# EAGLE design LilyPad_Rainbow_LED_v02 (EAGLE 7.7.0)
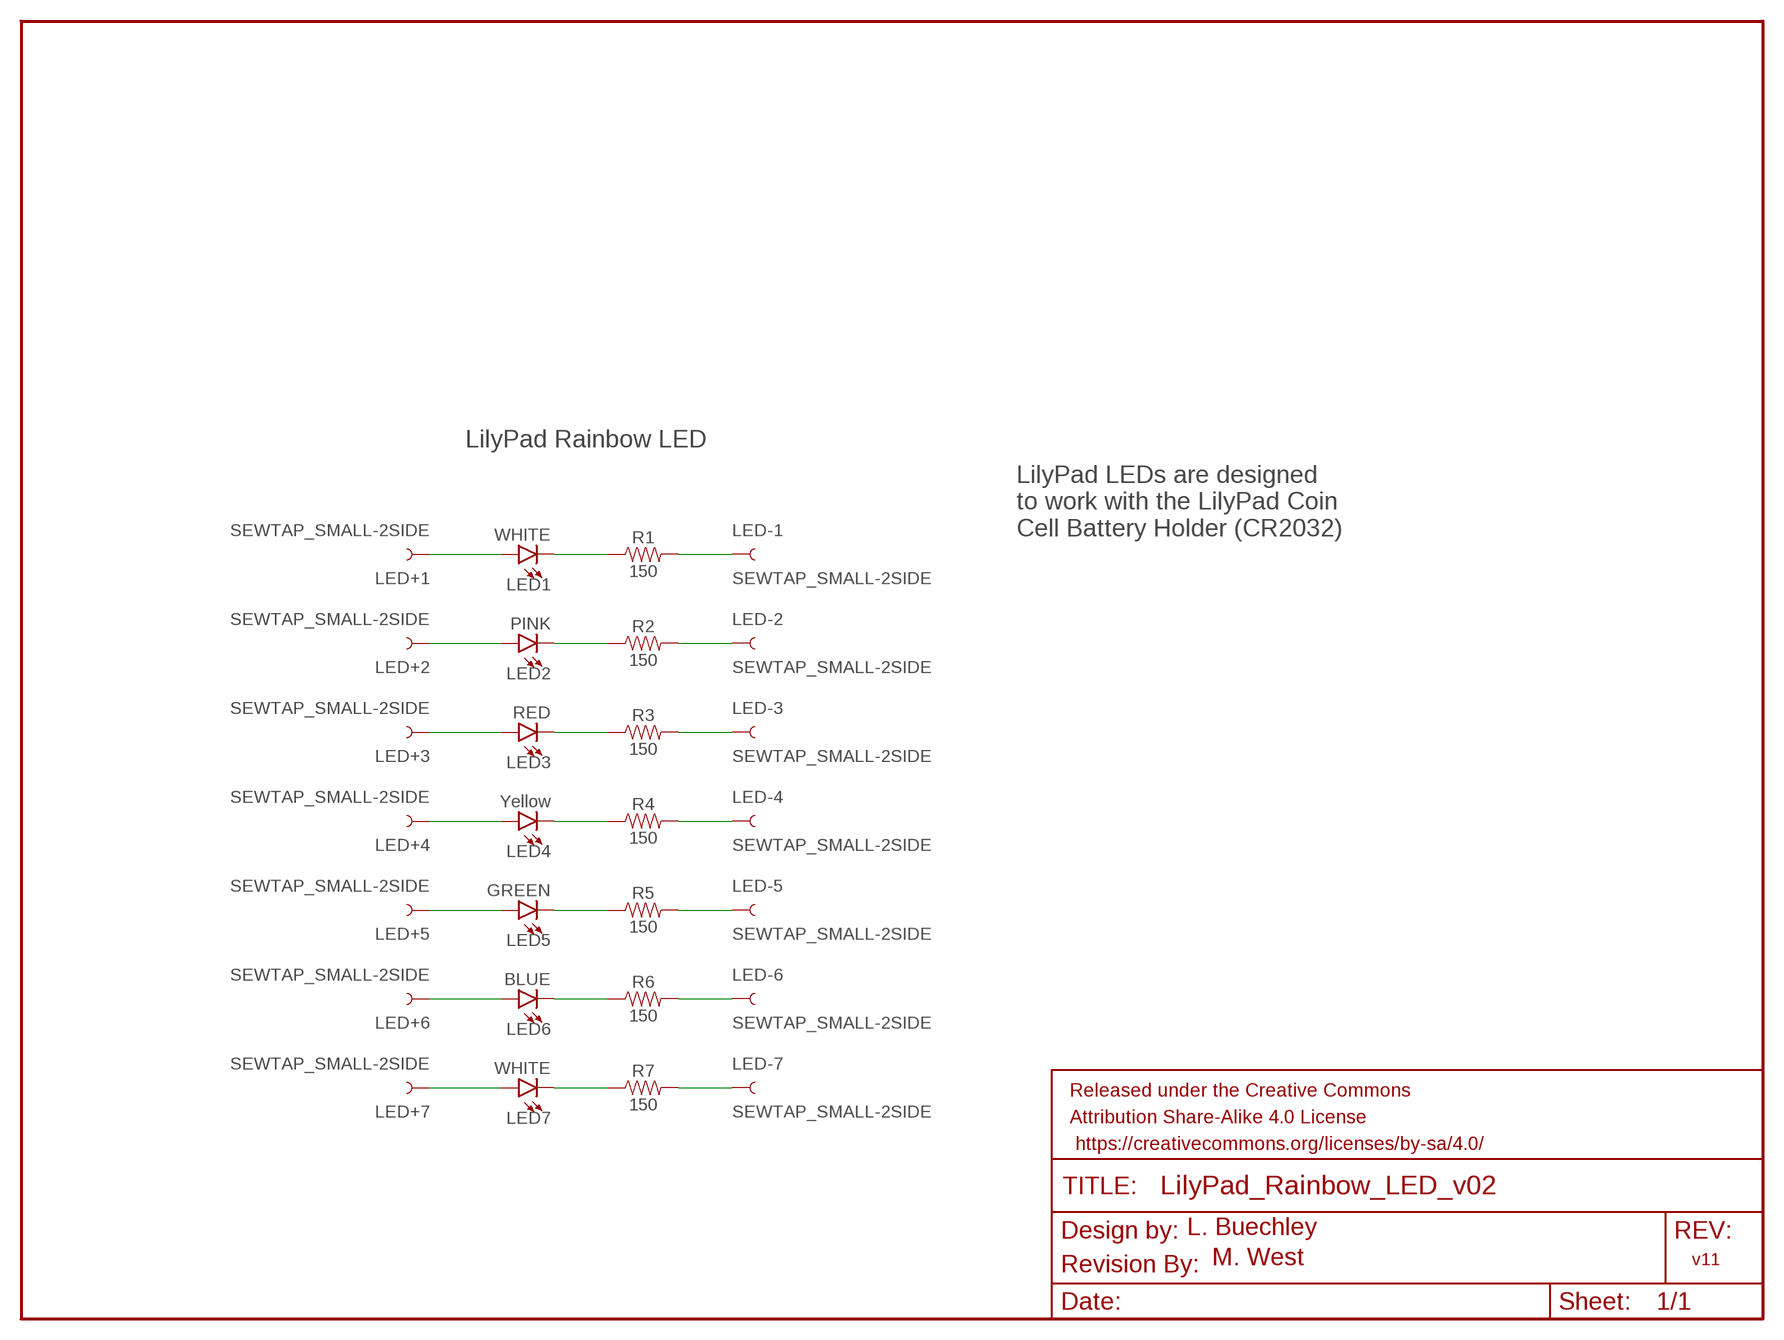
[diagram p0: schematic, sheet 1]

## Parts
FRAME1  FRAME-LETTER  [CREATIVE_COMMONS]
LED1  WHITE  LED-WHITE1206  [LED-1206]
LED2  PINK  LED-PINK1206  [LED-1206]
LED3  RED  LED-RED1206  [LED-1206]
LED4  Yellow  LED-YELLOWLILYPAD  [LED-1206]
LED5  GREEN  LED-GREENLILYPAD  [LED-1206]
LED6  BLUE  LED-BLUE1206  [LED-1206]
LED7  WHITE  LED-WHITE1206  [LED-1206]
LED+1  SEWTAP_SMALL-2SIDE  [PETAL-SMALL-2SIDE]
LED+2  SEWTAP_SMALL-2SIDE  [PETAL-SMALL-2SIDE]
LED+3  SEWTAP_SMALL-2SIDE  [PETAL-SMALL-2SIDE]
LED+4  SEWTAP_SMALL-2SIDE  [PETAL-SMALL-2SIDE]
LED+5  SEWTAP_SMALL-2SIDE  [PETAL-SMALL-2SIDE]
LED+6  SEWTAP_SMALL-2SIDE  [PETAL-SMALL-2SIDE]
LED+7  SEWTAP_SMALL-2SIDE  [PETAL-SMALL-2SIDE]
LED-1  SEWTAP_SMALL-2SIDE  [PETAL-SMALL-2SIDE]
LED-2  SEWTAP_SMALL-2SIDE  [PETAL-SMALL-2SIDE]
LED-3  SEWTAP_SMALL-2SIDE  [PETAL-SMALL-2SIDE]
LED-4  SEWTAP_SMALL-2SIDE  [PETAL-SMALL-2SIDE]
LED-5  SEWTAP_SMALL-2SIDE  [PETAL-SMALL-2SIDE]
LED-6  SEWTAP_SMALL-2SIDE  [PETAL-SMALL-2SIDE]
LED-7  SEWTAP_SMALL-2SIDE  [PETAL-SMALL-2SIDE]
R1  150  150OHM-0603-1/10W-1%  [0603]
R2  150  150OHM-0603-1/10W-1%  [0603]
R3  150  150OHM-0603-1/10W-1%  [0603]
R4  150  150OHM-0603-1/10W-1%  [0603]
R5  150  150OHM-0603-1/10W-1%  [0603]
R6  150  150OHM-0603-1/10W-1%  [0603]
R7  150  150OHM-0603-1/10W-1%  [0603]
U$1  REVISION  [REVISION]

## Nets
N$1: LED1.A LED+1.1
N$2: LED1.C R1.1
N$3: LED-1.1 R1.2
N$4: LED2.A LED+2.1
N$5: LED2.C R2.1
N$6: LED-2.1 R2.2
N$7: LED3.A LED+3.1
N$8: LED3.C R3.1
N$9: LED-3.1 R3.2
N$10: LED4.A LED+4.1
N$11: LED4.C R4.1
N$12: LED-4.1 R4.2
N$13: LED5.A LED+5.1
N$14: LED5.C R5.1
N$15: LED-5.1 R5.2
N$16: LED6.A LED+6.1
N$17: LED6.C R6.1
N$18: LED-6.1 R6.2
N$19: LED7.A LED+7.1
N$20: LED7.C R7.1
N$21: LED-7.1 R7.2

## Notes on the sheet
- LilyPad Rainbow LED
- LilyPad LEDs are designed
  to work with the LilyPad Coin
  Cell Battery Holder (CR2032)
- L. Buechley
- M. West | v11

## Library data of the parts
FRAME1 = SparkFun-Aesthetics:FRAME-LETTER: Schematic Frame - Letter Standard 8.5x11 US Letter frame
LED1 LED7 = SparkFun-LED:LED-WHITE: White SMD LED Used in manufacturing several products at SparkFun. Packages: 0603 - Bright White SMD 0603 package[Product Link] <http://www.kingbrightusa.com/product.asp?catalog_name=LED&product_id=APT1608QWF/D> 1206 - Bright White SMD1206 package [Product Link] <http://www.kingbrightusa.com/product.asp?catalog_name=LED&product_id=APT3216QWF/D> SparkFun Products: Blackberry Trackballer Breakout <https://www.sparkfun.com/products/13169> Digital SandBox <https://www.sparkfun.com/products/12651>; PROD_ID: DIO-09955
LED2 = SparkFun-LED:LED-PINK: Pink SMD LED Used in manufacturing of various products at SparkFun Packages: 0603 - SMD 0603 package [Product Link] <http://cdn.sparkfun.com/datasheets/Components/General/S1206PKSBJC.pdf> SparkFun Products: LilyPad LED Pink <https://www.sparkfun.com/products/10962>; PROD_ID: DIO-10415
LED3 = SparkFun-LED:LED-RED: Red SMD LED Used in manufacturing of most products at SparkFun Packages: 0603 - SMD 0603 package [Product Link] <http://docs.avagotech.com/docs/AV02-0551EN> 0603 SMART - SMD 0603 SMART package ( more efficient and expensive)[Product Link] <http://www.osram-os.com/Graphics/XPic2/00077099_0.pdf> 1206 - SMD1206 package [Product Link] <https://www.sparkfun.com/datasheets/DevTools/LilyPad/Q150OVS4.pdff> SparkFun Products: Pro Mini 328 -5V <https://www.sparkfun.com/products/821> RedBoard <https://www.sparkfun.com/products/12757> IOIO-OTG <https://www.sparkfun.com/products/13613>; PROD_ID: DIO-09912
LED4 = SparkFun-LED:LED-YELLOW: Yellow SMD LED Used in manufacturing several products at SparkFun. Packages: 0603 - SMD 0603 package[Product Link] <http://www.kingbrightusa.com/product.asp?catalog_name=LED&product_id=APT1608SYCK> 0603 -SMART - SMART SMD 0603 package (more efficient/more expensive) [Product Link] <http://www.osram-os.com/osram_os/en/products/product-catalog/led-light-emitting-diodes/smartled-0603/ly-l29k/index.jsp> LilyPad - SMD1206 package[Product Datasheet] <https://www.sparkfun.com/datasheets/DevTools/LilyPad/Q150YUS4.pdf> SparkFun Products: Blynk Board <https://www.sparkfun.com/products/13794> IOIO-OTG <https://www.sparkfun.com/products/13613> XBee Explorer Serial <https://www.sparkfun.com/products/13225>; PROD_ID: DIO-09909
LED5 = SparkFun-LED:LED-GREEN: Green SMD LED Used in manufacturing of various products at SparkFun Packages: 0603 - SMD 0603 package [Product Link] <http://www.futureelectronics.com/en/technologies/semiconductors/optoelectronics/leds/Pages/9894312-LTST-C190GKT.aspx?CrossPart=HSMG-C190&IM=0> LilyPad 1206 - SMD1206 LilyPad package [Product Link] <http://www.futureelectronics.com/en/Technologies/Product.aspx?ProductID=IN150NGHARVATEKCORPORATION2049943&IM=0> 1206 - SMD1206 package [Product Link] <http://www.futureelectronics.com/en/technologies/semiconductors/optoelectronics/leds/Pages/8315665-LTST-C150KGKT.aspx?IM=0> 1206 Bottom Mount -SMD 1206 Bottom Mount [Product Link] <http://www.digikey.com/product-detail/en/lite-on-inc/LTST-C230KGKT/160-1456-1-ND/386854> SparkFun Products: Pro Mini 328 -5V <https://www.sparkfun.com/products/821> RedBoard <https://www.sparkfun.com/products/12757> MP3 Trigger <https://www.sparkfun.com/products/13720> Makey Makey <https://www.sparkfun.com/products/11076>; PROD_ID: DIO-09910
LED6 = SparkFun-LED:LED-BLUE: Blue SMD LED Used in manufacturing of various products at SparkFun Packages: 0603 - SMD 0603 package [Product Link] <http://www.digikey.com/product-detail/en/SMLE12BC7TT86/511-1589-2-ND/1641808> 1206 - SMD1206 package [Product Link] <http://www.digikey.com/product-detail/en/lite-on-inc/LTST-C150TBKT/160-1643-1-ND/573584> SparkFun Products: ESP8266 Thing-Dev Board <https://www.sparkfun.com/products/13711> RedBoard <https://www.sparkfun.com/products/12757>; PROD_ID: DIO-09911
LED+1-LED+7 LED-1-LED-7 = LilyPad-Wearables:SEWTAP: SparkFun LilyPad Sew Taps Sewable connection points for LilyPad Boards SparkFun Products: LilyPad Arduino 328 Main Board <https://www.sparkfun.com/products/13342> LilyTiny <https://www.sparkfun.com/products/10899> LilyPad Power Supply <https://www.sparkfun.com/products/11259>
R1-R7 = SparkFun-Resistors:150OHM: 150Ω resistor A resistor is a passive two-terminal electrical component that implements electrical resistance as a circuit element. Resistors act to reduce current flow, and, at the same time, act to lower voltage levels within circuits. - Wikipedia; PROD_ID: RES-11028
U$1 = SparkFun-Aesthetics:REVISION: "Revision By" Text Preceding text for revisor documentation. Includes schematic text on "symbols" layer, and board text on tDoc.

## Board
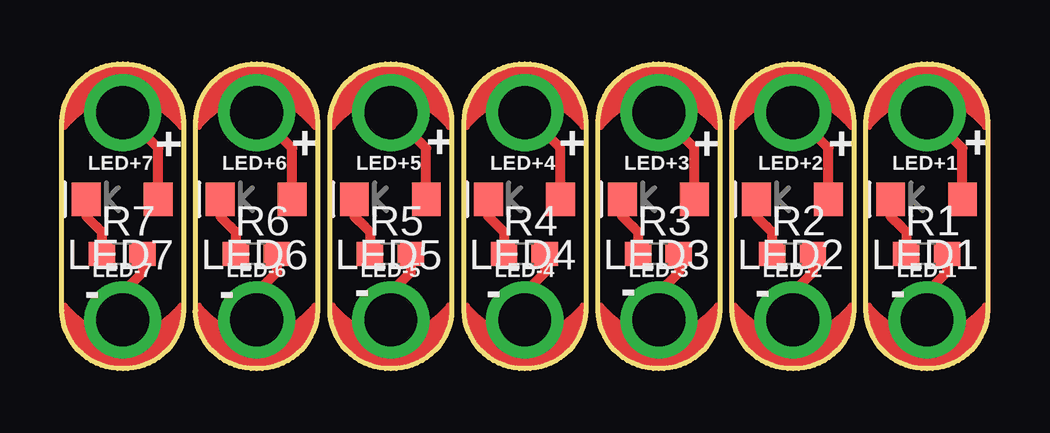
[diagram p1: board, top side]
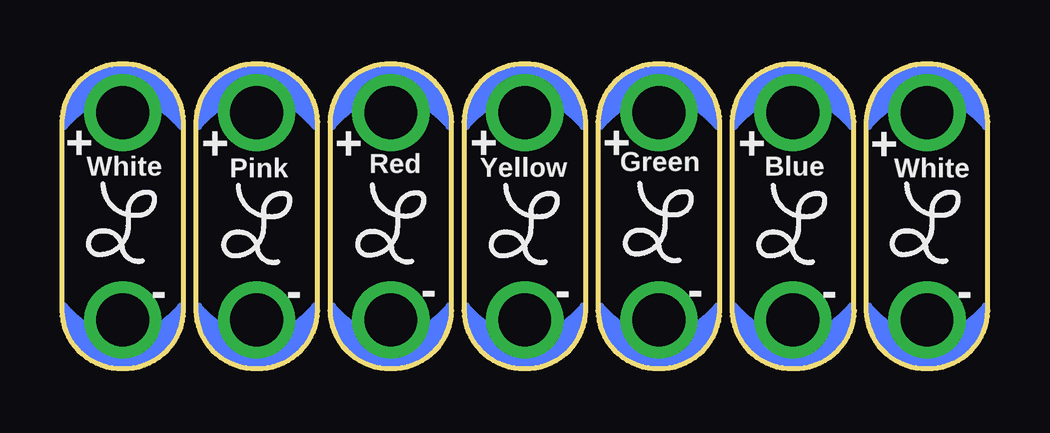
[diagram p2: board, bottom side, seen from below]

Size 38.61 x 12.7 mm. Coordinates in mm from the lower left corner, seen from the top.
Outline: 8.13,0 arc90 10.67,2.41 10.67,10.29 arc90 8.13,12.7 arc90 5.59,10.29 5.59,2.41
Outline: 8.1,0 arc-90 5.56,2.41
Outline: 27.43,10.29 27.43,2.41 arc-90 24.89,0 arc-90 22.35,2.41 22.35,10.29 arc-90 24.89,12.7 arc-90 27.43,10.29
Outline: 2.54,12.7 arc-90 5.08,10.29 5.08,2.41 arc-90 2.54,0 arc-90 0,2.41 0,10.29 arc-90 2.54,12.7
Outline: 13.72,12.7 arc-90 16.26,10.29 16.26,2.41 arc-90 13.72,0 arc-90 11.18,2.41 11.18,10.29 arc-90 13.72,12.7
Outline: 19.3,12.7 arc-90 21.84,10.29 21.84,2.41 arc-90 19.3,0 arc-90 16.76,2.41 16.76,10.29 arc-90 19.3,12.7
Outline: 30.48,12.7 arc-90 33.02,10.29 33.02,2.41 arc-90 30.48,0 arc-90 27.94,2.41 27.94,10.29 arc-90 30.48,12.7
Outline: 36.07,12.7 arc-90 38.61,10.29 38.61,2.41 arc-90 36.07,0 arc-90 33.53,2.41 33.53,10.29 arc-90 36.07,12.7
Copper layers (1*16): Top 0.035mm / dielectric 1.5mm / Bottom 0.035mm
Design rules "SparkFun-2-layer-STANDARD": minimum track width 10mil, minimum drill 20mil, track to track 10mil, track to pad 8mil, pad to pad 8mil, via to via 10mil, smd to smd 8mil, copper to edge 8mil, drill to drill 8mil, minimum pad ring 10mil, minimum via ring 10mil, stop-mask expansion 4mil, vias tented up to drill 25mil, thermal gap 10mil

### Footprints (pad centres in the part's own frame; a part is rotated, then mirrored left to right if it is on the bottom)
LED-1206 = smd 1.2 x 1.4: A -1.5,0; C 1.5,0
PETAL-SMALL-2SIDE = drill 2.2: 1 0,0
0603 = smd 1.1 x 1: 1 -0.85,0; 2 0.85,0

### Placement (x,y rotation side)
FRAME1  14.73,-8.26 0 top  (outside the outline)
LED1  36.05,7.06 180 top
LED2  30.46,7.06 180 top
LED3  24.87,7.06 180 top
LED4  19.28,7.06 180 top
LED5  13.7,7.06 180 top
LED6  8.11,7.06 180 top
LED7  2.52,7.06 180 top
LED+1  36.07,10.67 180 top
LED+2  30.48,10.67 180 top
LED+3  24.89,10.67 180 top
LED+4  19.3,10.67 180 top
LED+5  13.72,10.67 180 top
LED+6  8.13,10.67 180 top
LED+7  2.54,10.67 180 top
LED-1  36.07,2.03 0 top
LED-2  30.48,2.03 0 top
LED-3  24.89,2.03 0 top
LED-4  19.3,2.03 0 top
LED-5  13.72,2.03 0 top
LED-6  8.13,2.03 0 top
LED-7  2.54,2.03 0 top
LOGO29  LOGO-LPL  [LOGO-L]  24.89,6.05 0 bottom
LOGO30  LOGO-LPL  [LOGO-L]  2.62,6.07 0 bottom
LOGO31  LOGO-LPL  [LOGO-L]  8.18,6.02 0 bottom
LOGO32  LOGO-LPL  [LOGO-L]  13.74,6.1 0 bottom
LOGO33  LOGO-LPL  [LOGO-L]  19.33,6.02 0 bottom
LOGO34  LOGO-LPL  [LOGO-L]  30.48,6.02 0 bottom
LOGO35  LOGO-LPL  [LOGO-L]  36.12,6.07 0 bottom
R1  36.05,4.78 0 top
R2  30.46,4.78 0 top
R3  24.87,4.78 0 top
R4  19.28,4.78 0 top
R5  13.7,4.78 0 top
R6  8.11,4.78 0 top
R7  2.52,4.78 0 top
U$1  26.16,-10.79 0 top  (outside the outline)

### Tracks (layer width: path | path; a pad name or v marks a point on that pad's centre or on a via)
N$1
  Top 0.406: LED1.A 37.55,9.19 LED+1.1
N$2
  Top 0.254: 34.99,5.91 35.05,5.84
  Top 0.406: LED1.C 34.55,6.35 34.99,5.91 35.2,5.7 R1.1
N$3
  Top 0.406: LED-1.1 36.07,3.17 36.9,4 R1.2
N$4
  Top 0.406: LED2.A 31.96,9.19 LED+2.1
N$5
  Top 0.254: 29.4,5.91 29.46,5.84
  Top 0.406: LED2.C 28.96,6.35 29.4,5.91 29.61,5.7 R2.1
N$6
  Top 0.406: LED-2.1 30.48,3.17 31.31,4 R2.2
N$7
  Top 0.406: LED3.A 26.37,9.19 LED+3.1
N$8
  Top 0.254: 23.81,5.91 23.88,5.84
  Top 0.406: LED3.C 23.37,6.35 23.81,5.91 24.02,5.7 R3.1
N$9
  Top 0.406: LED-3.1 24.89,3.17 25.72,4 R3.2
N$10
  Top 0.406: LED4.A 20.78,9.19 LED+4.1
N$11
  Top 0.254: 18.23,5.91 18.29,5.84
  Top 0.406: LED4.C 17.78,6.35 18.23,5.91 18.43,5.7 R4.1
N$12
  Top 0.406: LED-4.1 19.3,3.17 20.13,4 R4.2
N$13
  Top 0.406: 13.72,10.79 LED+5.1 15.2,9.19 LED5.A
N$14
  Top 0.254: 12.64,5.91 12.7,5.84
  Top 0.406: LED5.C 12.2,6.35 12.64,5.91 12.85,5.7 R5.1
N$15
  Top 0.406: LED-5.1 13.72,3.17 14.55,4 R5.2
N$16
  Top 0.406: LED6.A 9.61,9.19 LED+6.1
N$17
  Top 0.254: 7.05,5.91 7.11,5.84
  Top 0.406: LED6.C 6.61,6.35 7.05,5.91 7.26,5.7 R6.1
N$18
  Top 0.406: LED-6.1 8.13,3.17 8.96,4 R6.2
N$19
  Top 0.406: LED7.A 4.02,9.19 LED+7.1
N$20
  Top 0.254: 1.46,5.91 1.52,5.84
  Top 0.406: LED7.C 1.02,6.35 1.46,5.91 1.67,5.7 R7.1
N$21
  Top 0.406: LED-7.1 2.54,3.17 3.37,4 R7.2

### Text on the board
tPlace: + | + | + | + | + | + | + | - | - | - | - | - | - | -
bPlace: + | + | Green | + | + | Red | + | + | + | White | Blue | Yellow | Pink | White | - | - | - | - | - | - | -
Measures: All Units Inches
tDocu: 0.032" board thickness / Purple Solder Mask | L. Buechley | M. West | v11